# EAGLE schematic Shield (EAGLE 6.1)
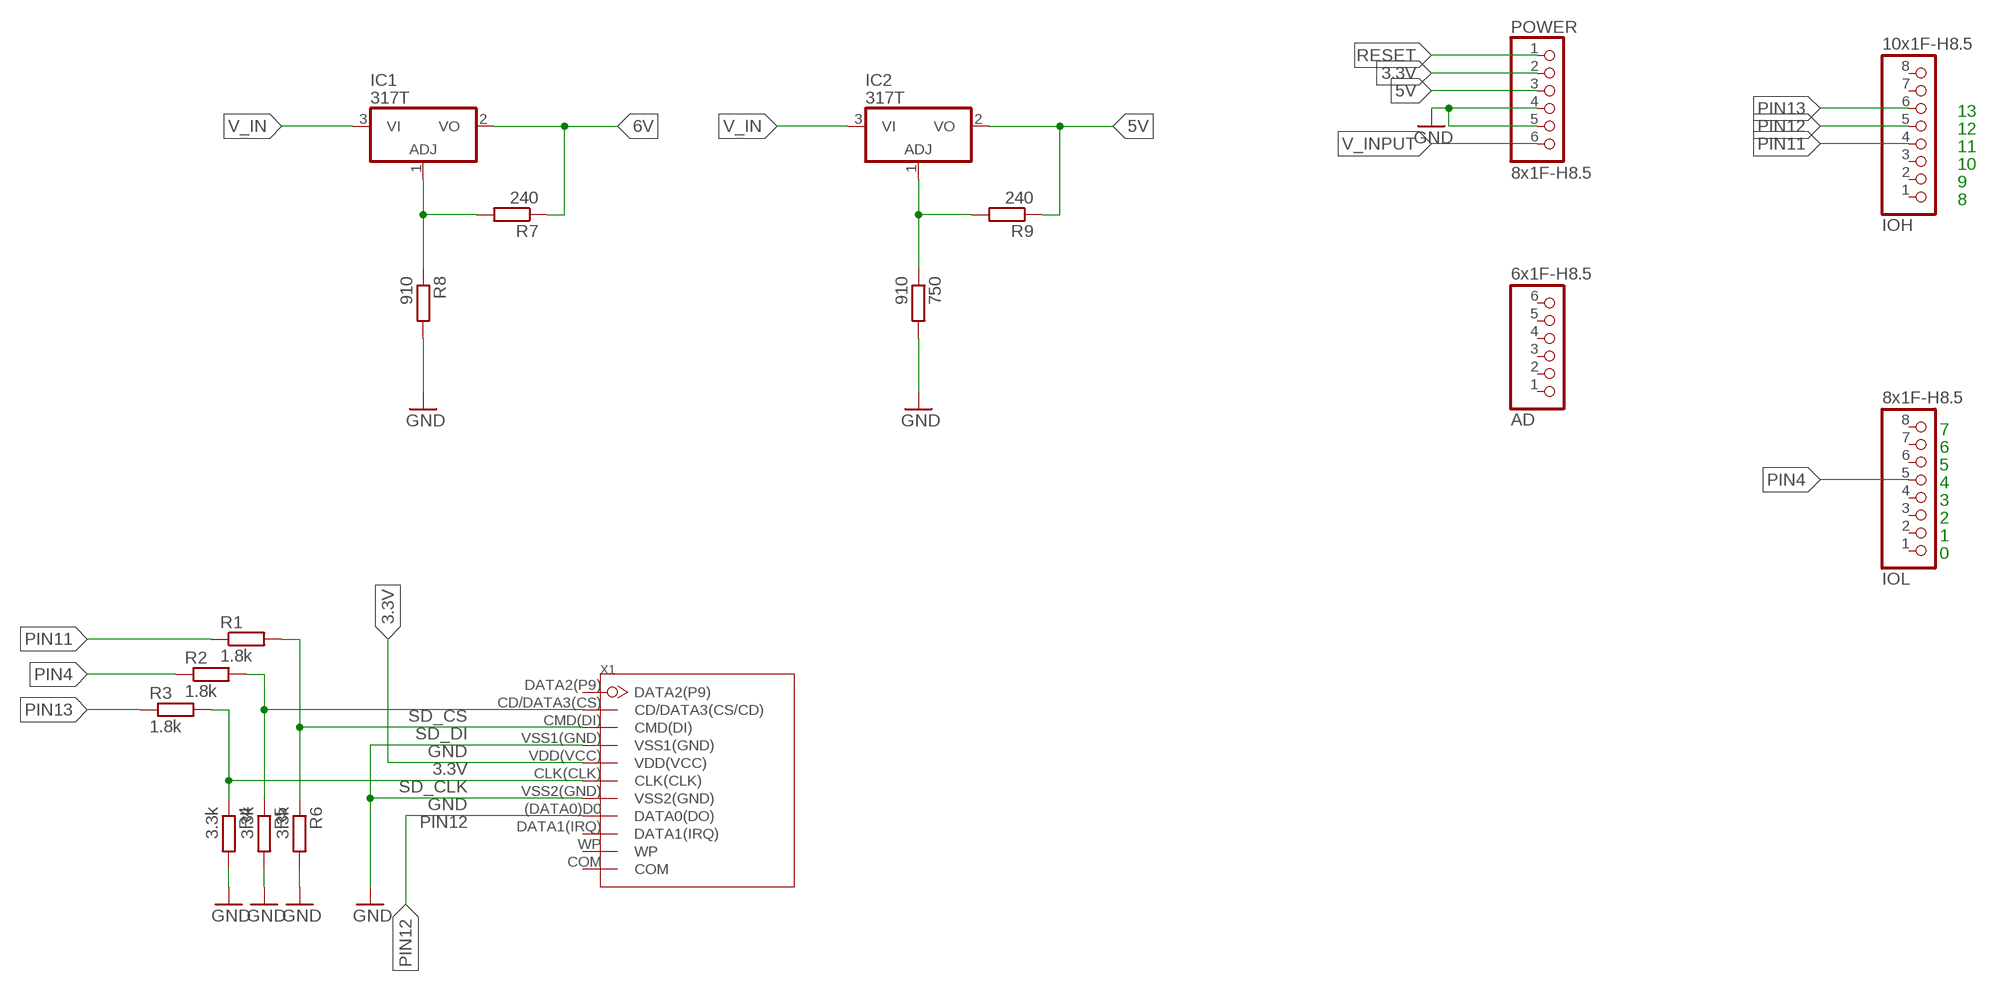
[diagram p0: schematic, sheet 1]

## Parts
750  910  R-EU_R0805  [R0805]
AD  6x1F-H8.5  PINHD-1X6  [1X06@1]
IC1  317T  [TO220H]
IC2  317T  [TO220H]
IOH  10x1F-H8.5  PINHD-1X8  [1X08]
IOL  8x1F-H8.5  PINHD-1X8  [1X08@1]
POWER  8x1F-H8.5  PINHD-1X6  [1X06]
R1  1.8k  R-EU_R0805  [R0805]
R2  1.8k  R-EU_R0805  [R0805]
R3  1.8k  R-EU_R0805  [R0805]
R4  3.3k  R-EU_R0805  [R0805]
R5  3.3k  R-EU_R0805  [R0805]
R6  3.3k  R-EU_R0805  [R0805]
R7  240  R-EU_R0805  [R0805]
R8  910  R-EU_R0805  [R0805]
R9  240  R-EU_R0805  [R0805]
X1  SDCARDEXTDEVICE  [SDCARDEXTPACKAGE]

## Nets
3.3V: POWER.2 X1.VDD(VCC)
5V: IC2.2(VO) POWER.3 R9.1
6V: IC1.2(VO) R7.1
GND: 750.2 POWER.4 POWER.5 R4.2 R5.2 R6.2 R8.2 X1.VSS1(GND) X1.VSS2(GND)
N$1: IC1.1(ADJ) R7.2 R8.1
N$2: 750.1 IC2.1(ADJ) R9.2
PIN4: IOL.5 R2.1
PIN11: IOH.4 R1.1
PIN12: IOH.5 X1.(DATA0)D0(DATA0(DO))
PIN13: IOH.6 R3.1
RESET: POWER.1
SD_CLK: R3.2 R4.1 X1.CLK(CLK)
SD_CS: R2.2 R5.1 X1.CD/DATA3(CS)(CD/DATA3(CS/CD))
SD_DI: R1.2 R6.1 X1.CMD(DI)
V_IN: IC1.3(VI) IC2.3(VI)
V_INPUT: POWER.6
Unconnected: AD.1 AD.2 AD.3 AD.4 AD.5 AD.6 IOH.1 IOH.2 IOH.3 IOH.7 IOH.8 IOL.1 IOL.2 IOL.3 IOL.4 IOL.6 IOL.7 IOL.8 X1.COM X1.DATA1(IRQ) X1.DATA2(P9) X1.WP

## Notes on the sheet
- 13
- 12
- 11
- 10
- 9
- 8
- 7
- 6
- 5
- 4
- 3
- 2
- 1
- 0

## Library data of the parts
750 R1-R9 = resistor:R-EU_: RESISTOR, European symbol
AD = SmartPrj:PINHD-1X6: PIN HEADER
IC1 IC2 = linear:*317: Positive VOLTAGE REGULATOR
IOH = pinhead:PINHD-1X8: PIN HEADER
IOL = SmartPrj:PINHD-1X8: PIN HEADER
POWER = pinhead:PINHD-1X6: PIN HEADER
X1 = SD card breakout:SDCARDEXTDEVICE

## Net classes
0 default: clearance 0.152 mm
1 power: width 0.61 mm, drill 0.61 mm, clearance 0.254 mm
2 gnd: width 0.305 mm, drill 0.559 mm, clearance 0.254 mm
3 usbvcc: width 0.508 mm, drill 0.61 mm, clearance 0.254 mm
4 aref: width 0.406 mm, drill 0.61 mm, clearance 0.254 mm